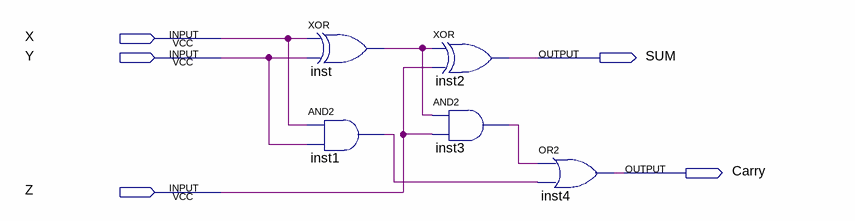
[diagram p0: schematic sheet]
// Quartus schematic adder.bdf as structural Verilog: 5 symbols, 5 pins
module adder (
  input  X,
  input  Y,
  input  Z,
  output SUM,
  output Carry
);

  wire inst1_out, inst3_out, inst_out;

  xor inst (inst_out, X, Y);
  and inst1 (inst1_out, X, Y);
  xor inst2 (SUM, inst_out, Z);
  and inst3 (inst3_out, inst_out, Z);
  or inst4 (Carry, inst3_out, inst1_out);
endmodule
